# EasyEDA Pro project 验证板2.epro

# Schematic 验证板2

## Sheets
1 BUF634A三通道缓冲器: Board Name: WEN-验证板合集2; Create Date: 2025-05-11; Page Name: BUF634A三通道缓冲器; Project Name: 【电赛模块】2025电赛预制模块mmkk; Schematic Name: 验证板2; Update Date: 2025-05-13; Company: 嘉立创EDA; Page Size: A1; Version: V1.0
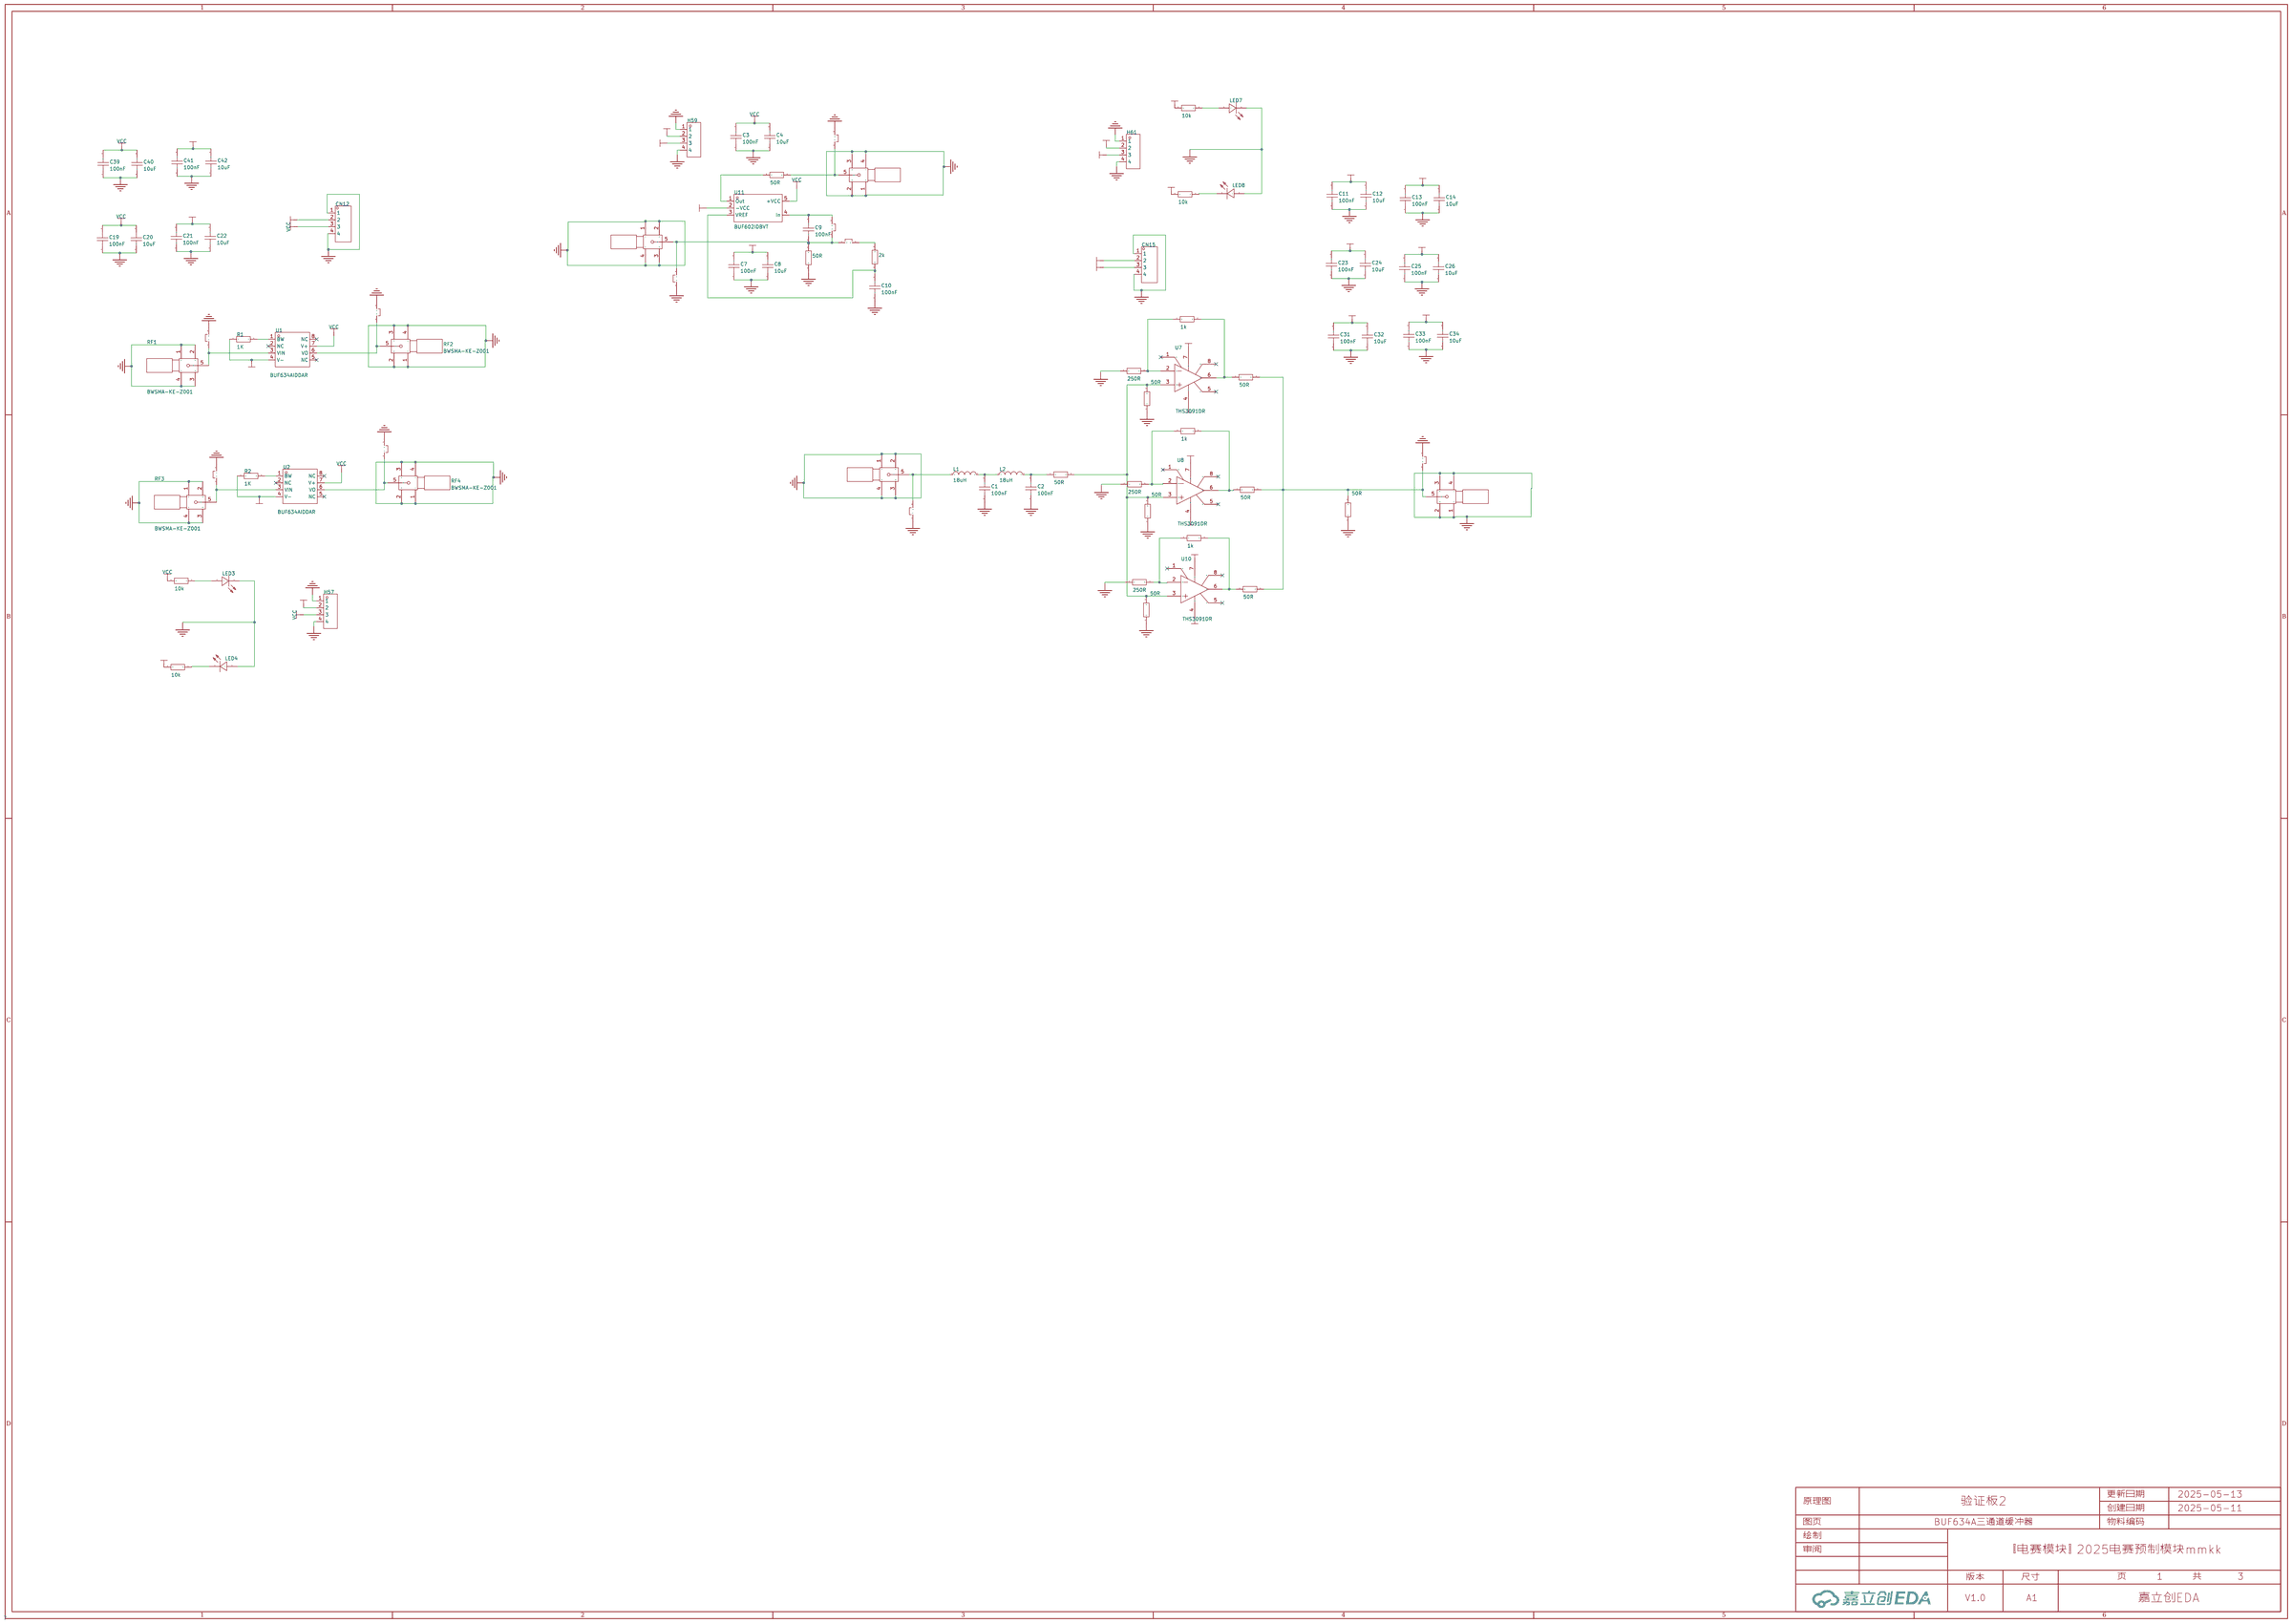
[diagram p0: BUF634A三通道缓冲器]
2 AD835乘法器: Create Date: 2025-05-13; Page Name: AD835乘法器
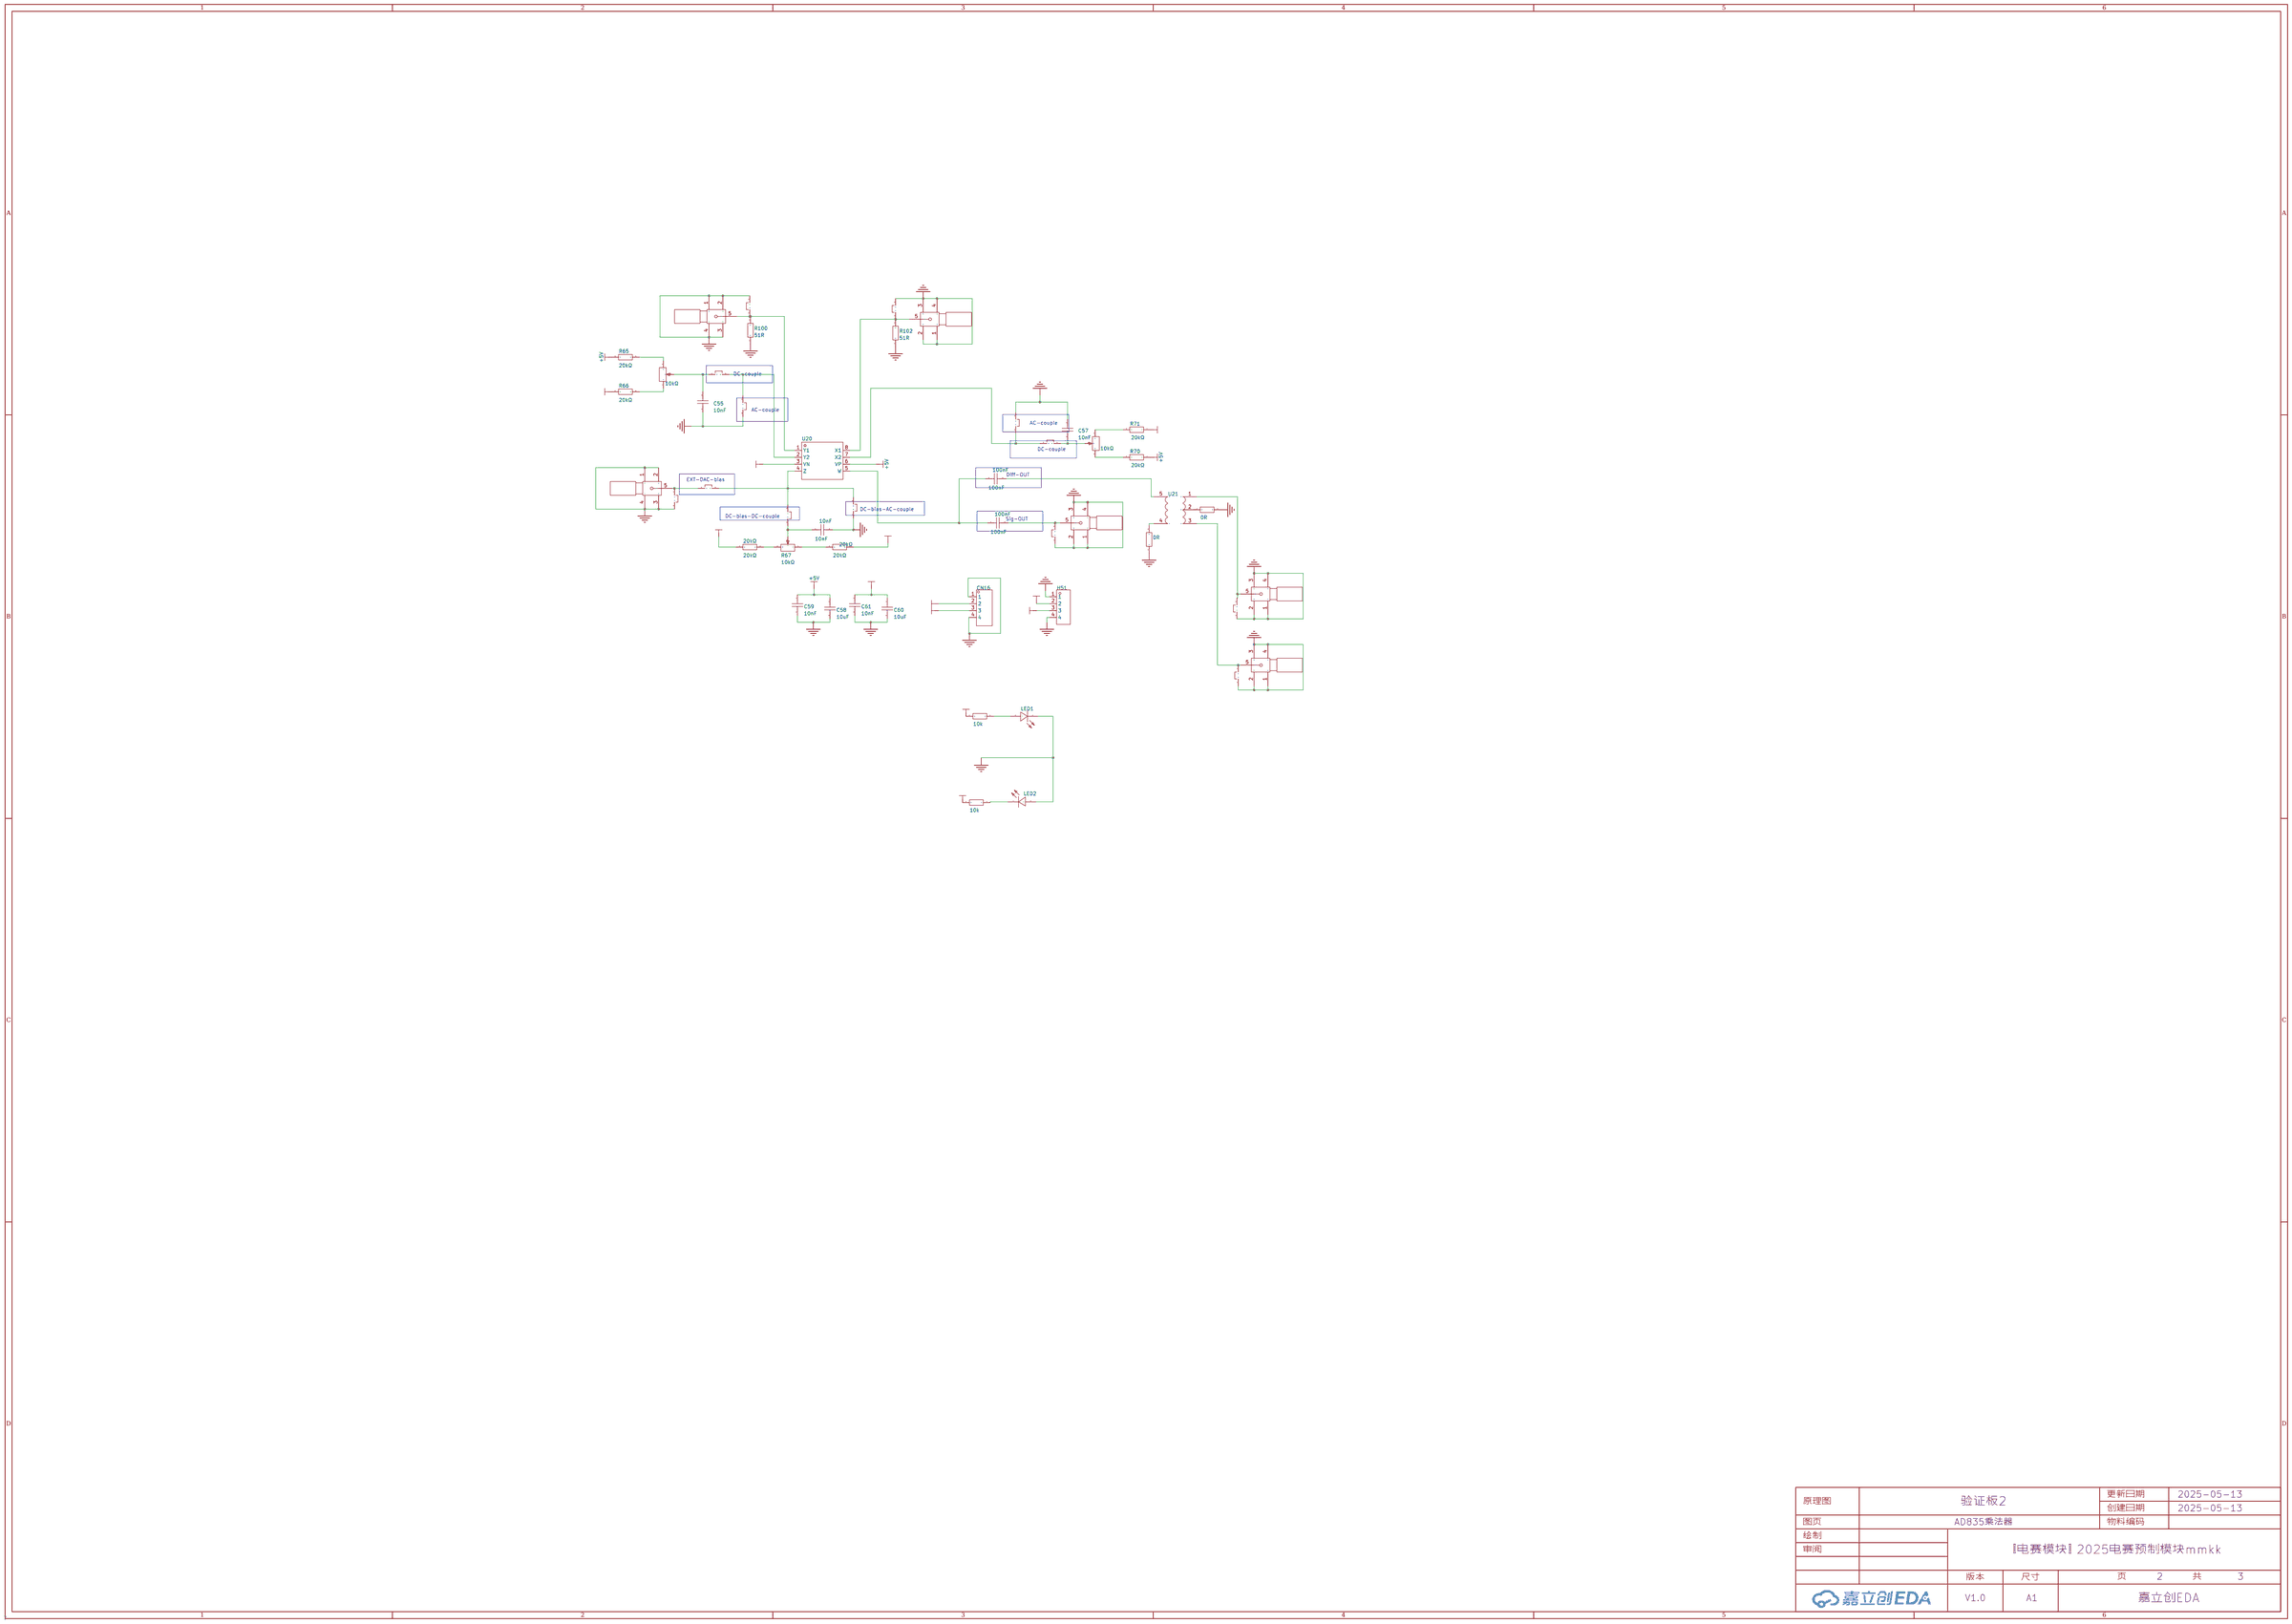
[diagram p1: AD835乘法器]
3 OPA690+CD4051数控增益AMP: Create Date: 2025-05-13; Page Name: OPA690+CD4051数控增益AMP
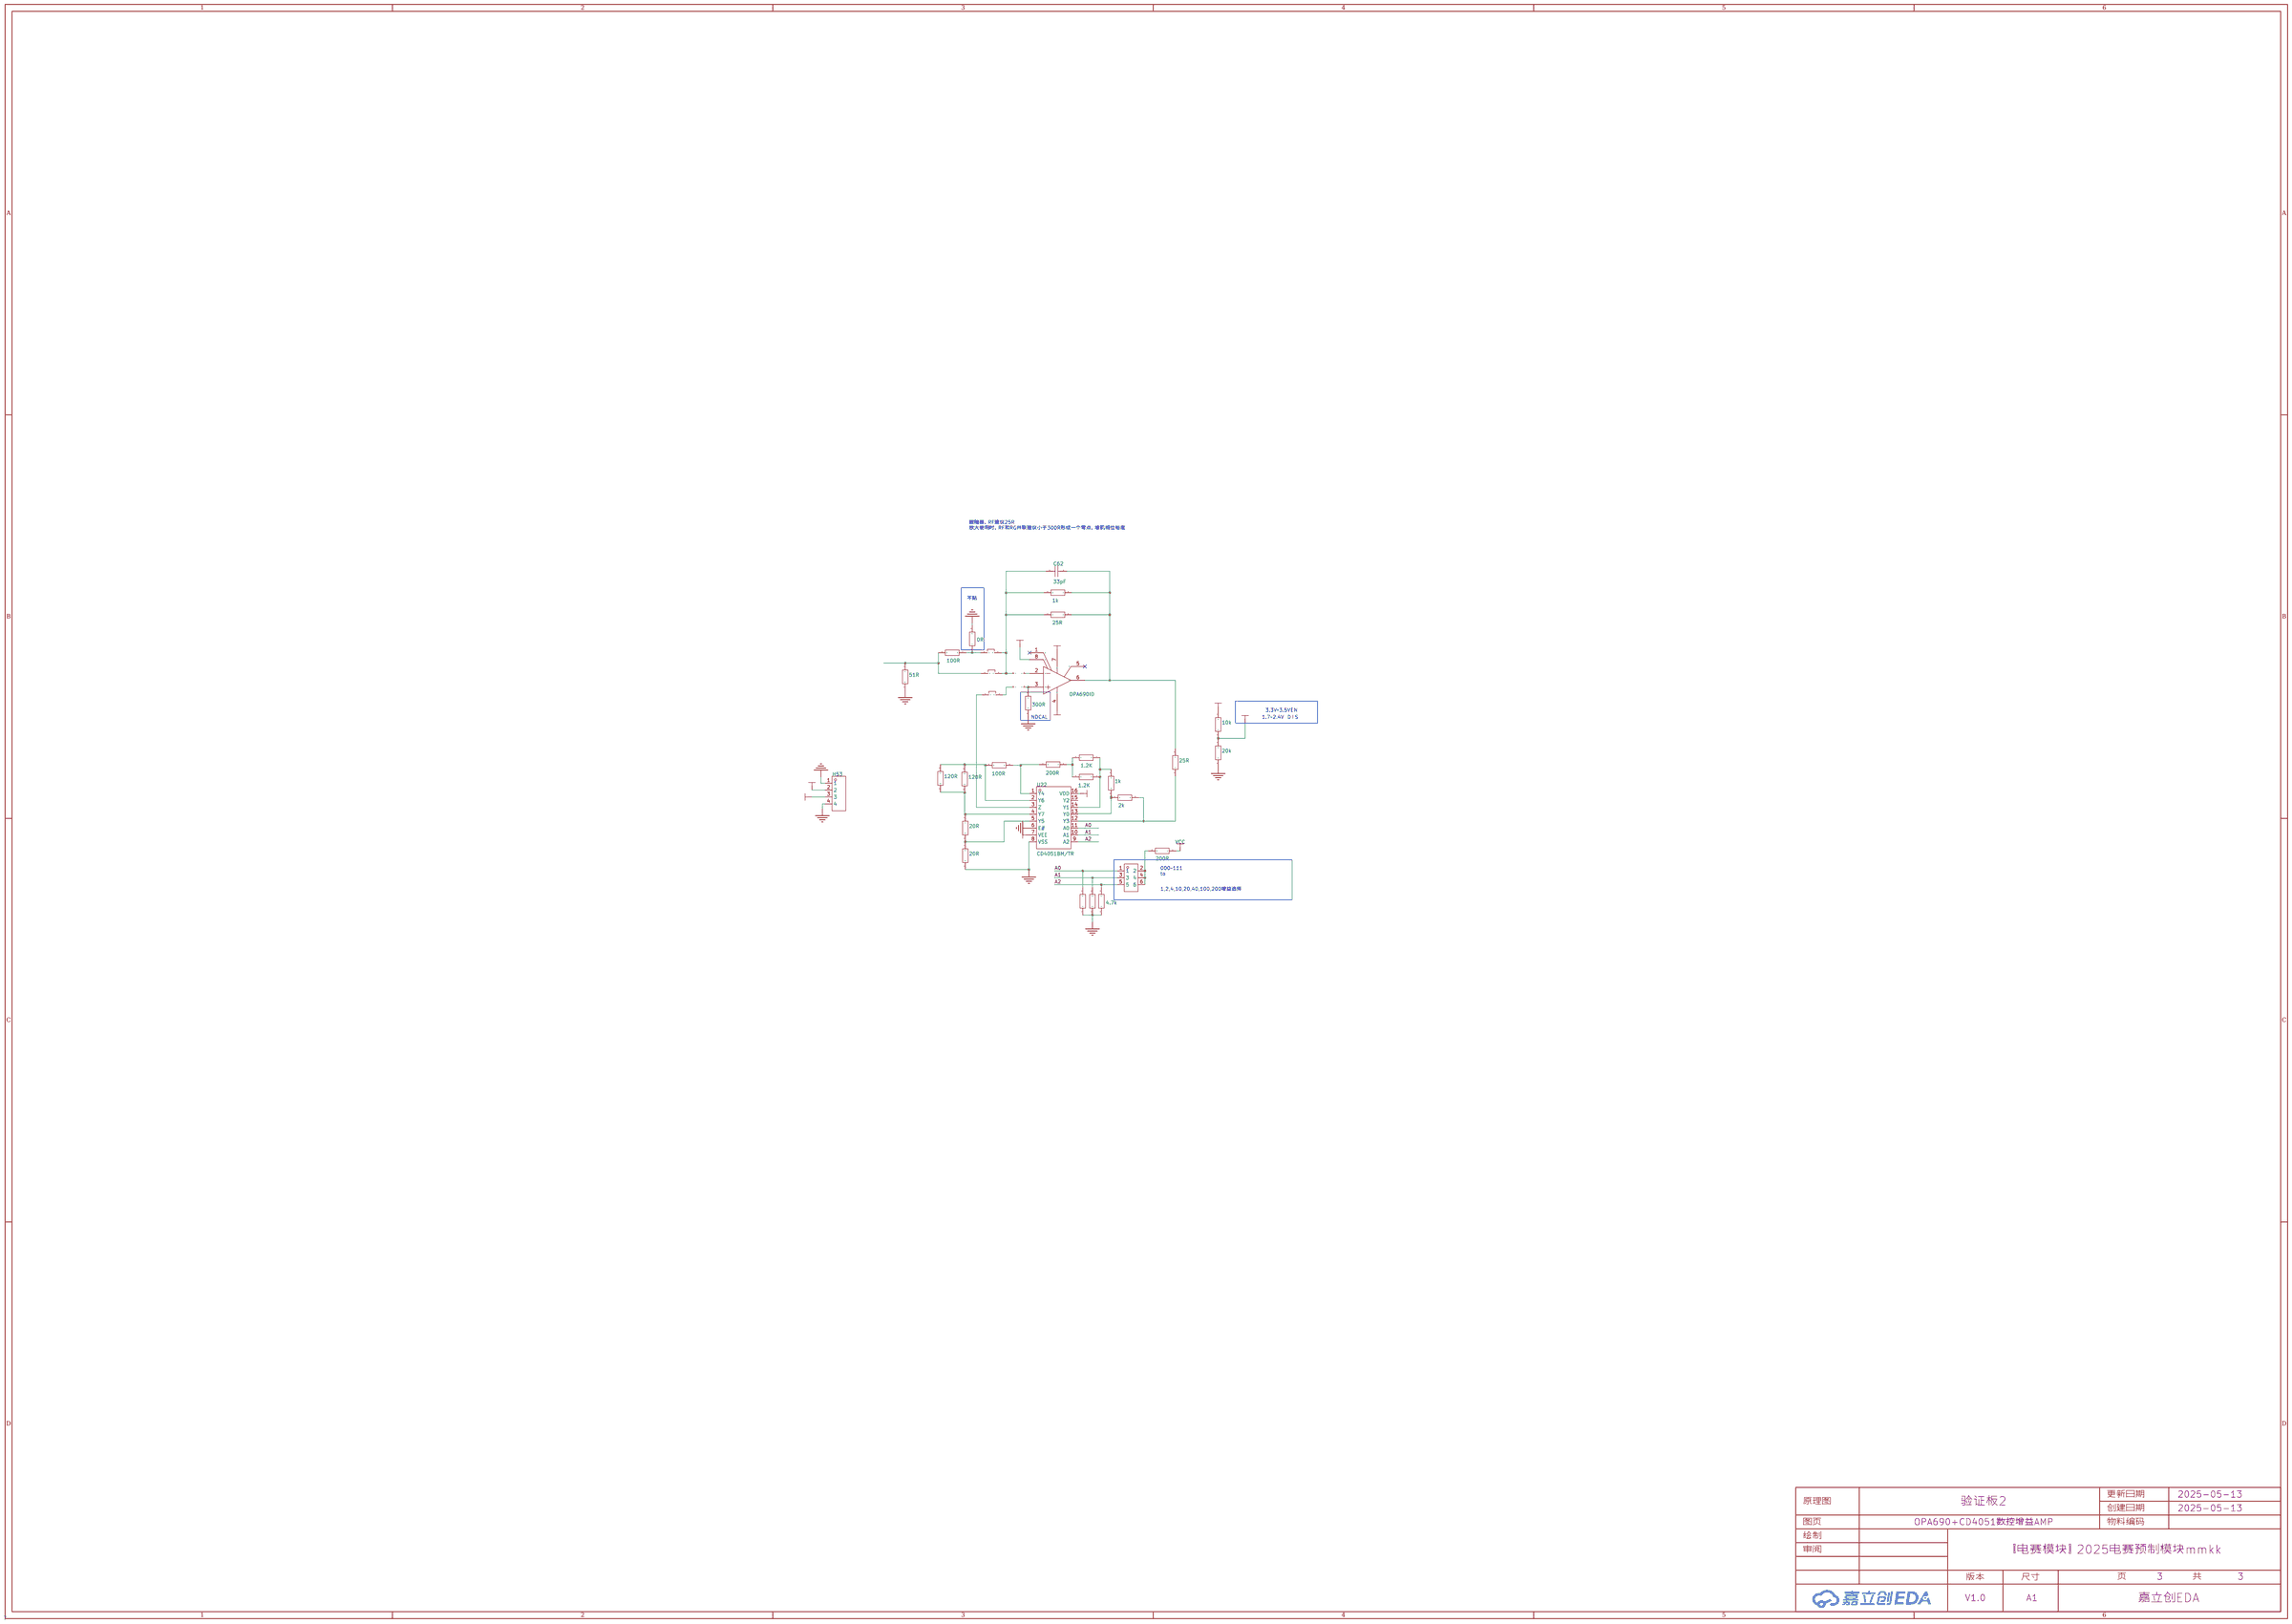
[diagram p2: OPA690+CD4051数控增益AMP]

## Parts
sheet AD835乘法器
0R1  0R  [R0603]
0R2  0R  [R0603]
10nF  10nF  [C0805]
20kΩ  20kΩ  [R0603]
20kΩ#2  20kΩ  [R0603]
100nF  100nF  [C0805]
100nF#2  100nF  [C0805]
C55  10nF  [C0805]
C57  10nF  [C0805]
C58  10uF  [C0805]
C59  10nF  [C0805]
C60  10uF  [C0805]
C61  10nF  [C0805]
CN16  WJ15EDGVC-3.81-4P  [CONN-TH_4P-P3.81_WJ2EDGVC-3.81-4P]
H34  PZ254V-11-02P  [HDR-TH_2P-P2.54-V-M]
H35  PZ254V-11-02P  [HDR-TH_2P-P2.54-V-M]
H36  PZ254V-11-02P  [HDR-TH_2P-P2.54-V-M]
H37  PZ254V-11-02P  [HDR-TH_2P-P2.54-V-M]
H38  PZ254V-11-02P  [HDR-TH_2P-P2.54-V-M]
H39  PZ254V-11-02P  [HDR-TH_2P-P2.54-V-M]
H40  PZ254V-11-02P  [HDR-TH_2P-P2.54-V-M]
H45  PZ254V-11-02P  [HDR-TH_2P-P2.54-V-M]
H46  PZ254V-11-02P  [HDR-TH_2P-P2.54-V-M]
H47  PZ254V-11-02P  [HDR-TH_2P-P2.54-V-M]
H48  PZ254V-11-02P  [HDR-TH_2P-P2.54-V-M]
H50  PZ254V-11-02P  [HDR-TH_2P-P2.54-V-M]
H51  PZ254V-11-04P  [HDR-TH_4P-P2.54-V-M]
H56  PZ254V-11-02P  [HDR-TH_2P-P2.54-V-M]
LED1  LTST-C190KSKT  [LED0603-RD]
LED2  LTST-C190KSKT  [LED0603-RD]
R65  20kΩ  [R0603]
R66  20kΩ  [R0603]
R67  10kΩ  [RES-ADJ-TH_3296W]
R70  20kΩ  [R0603]
R71  20kΩ  [R0603]
R75  0R  [R0603]
R100  51R  [R0603]
R102  51R  [R0603]
R103  0R  [R0603]
RF18  BWSMA-KE-Z001  [SMA-TH_BWSMA-KE-Z001]
RF19  BWSMA-KE-Z001  [SMA-TH_BWSMA-KE-Z001]
RF20  BWSMA-KE-Z001  [SMA-TH_BWSMA-KE-Z001]
RF21  BWSMA-KE-Z001  [SMA-TH_BWSMA-KE-Z001]
RF22  BWSMA-KE-Z001  [SMA-TH_BWSMA-KE-Z001]
RF23  BWSMA-KE-Z001  [SMA-TH_BWSMA-KE-Z001]
U20  AD835ARZ  [SOIC-8_L4.9-W3.9-P1.27-LS6.0-TL]
U21  -  [BALUN巴伦变压器（5端）]
Y3  10kΩ  [RES-ADJ-TH_3296W]
Y6  10kΩ  [RES-ADJ-TH_3296W]
sheet BUF634A三通道缓冲器
0R3  0R  [R0603]
0R4  0R  [R0603]
0R7  0R  [R0603]
0R8  0R  [R0603]
C1  100nF  [C0805]
C2  100nF  [C0805]
C3  100nF  [C0805]
C4  10uF  [C0805]
C7  100nF  [C0805]
C8  10uF  [C0805]
C9  100nF  [C0805]
C10  100nF  [C0805]
C11  100nF  [C0805]
C12  10uF  [C0805]
C13  100nF  [C0805]
C14  10uF  [C0805]
C19  100nF  [C0805]
C20  10uF  [C0805]
C21  100nF  [C0805]
C22  10uF  [C0805]
C23  100nF  [C0805]
C24  10uF  [C0805]
C25  100nF  [C0805]
C26  10uF  [C0805]
C31  100nF  [C0805]
C32  10uF  [C0805]
C33  100nF  [C0805]
C34  10uF  [C0805]
C39  100nF  [C0805]
C40  10uF  [C0805]
C41  100nF  [C0805]
C42  10uF  [C0805]
CN12  WJ15EDGVC-3.81-4P  [CONN-TH_4P-P3.81_WJ2EDGVC-3.81-4P]
CN15  WJ15EDGVC-3.81-4P  [CONN-TH_4P-P3.81_WJ2EDGVC-3.81-4P]
H1  PZ254V-11-02P  [HDR-TH_2P-P2.54-V-M]
H2  PZ254V-11-02P  [HDR-TH_2P-P2.54-V-M]
H3  PZ254V-11-02P  [HDR-TH_2P-P2.54-V-M]
H4  PZ254V-11-02P  [HDR-TH_2P-P2.54-V-M]
H5  PZ254V-11-02P  [HDR-TH_2P-P2.54-V-M]
H6  PZ254V-11-02P  [HDR-TH_2P-P2.54-V-M]
H7  PZ254V-11-02P  [HDR-TH_2P-P2.54-V-M]
H8  PZ254V-11-02P  [HDR-TH_2P-P2.54-V-M]
H9  PZ254V-11-02P  [HDR-TH_2P-P2.54-V-M]
H10  PZ254V-11-02P  [HDR-TH_2P-P2.54-V-M]
H57  PZ254V-11-04P  [HDR-TH_4P-P2.54-V-M]
H59  PZ254V-11-04P  [HDR-TH_4P-P2.54-V-M]
H61  PZ254V-11-04P  [HDR-TH_4P-P2.54-V-M]
L1  18uH  [L0805]
L2  18uH  [L0805]
LED3  LTST-C190KSKT  [LED0603-RD]
LED4  LTST-C190KSKT  [LED0603-RD]
LED7  LTST-C190KSKT  [LED0603-RD]
LED8  LTST-C190KSKT  [LED0603-RD]
R1  1K  [R0603]
R2  1K  [R0603]
R7  1K  [R0603]
R8  1K  [R0603]
R10  1K  [R0603]
R11  1K  [R0603]
R12  1K  [R0603]
R13  1K  [R0603]
R14  1K  [R0603]
R15  1K  [R0603]
R16  1K  [R0603]
R17  1K  [R0603]
R18  1K  [R0603]
R19  1K  [R0603]
R22  1K  [R0603]
R23  1K  [R0603]
R24  1K  [R0603]
R26  1K  [R0603]
R27  1K  [R0603]
RF1  BWSMA-KE-Z001  [SMA-TH_BWSMA-KE-Z001]
RF2  BWSMA-KE-Z001  [SMA-TH_BWSMA-KE-Z001]
RF3  BWSMA-KE-Z001  [SMA-TH_BWSMA-KE-Z001]
RF4  BWSMA-KE-Z001  [SMA-TH_BWSMA-KE-Z001]
RF5  BWSMA-KE-Z001  [SMA-TH_BWSMA-KE-Z001]
RF6  BWSMA-KE-Z001  [SMA-TH_BWSMA-KE-Z001]
RF7  BWSMA-KE-Z001  [SMA-TH_BWSMA-KE-Z001]
RF8  BWSMA-KE-Z001  [SMA-TH_BWSMA-KE-Z001]
U1  BUF634AIDDAR  [SOIC-8_L4.9-W3.9-P1.27-LS6.0-BL]
U2  BUF634AIDDAR  [SOIC-8_L4.9-W3.9-P1.27-LS6.0-BL]
U7  THS3091DR  [SOIC-8_L4.9-W3.9-P1.27-LS6.0-BL]
U8  THS3091DR  [SOIC-8_L4.9-W3.9-P1.27-LS6.0-BL]
U10  THS3091DR  [SOIC-8_L4.9-W3.9-P1.27-LS6.0-BL]
U11  BUF602IDBVT  [SOT-23-5_L2.9-W1.6-P0.95-LS2.8-BL]
sheet OPA690+CD4051数控增益AMP
C62  33pF  [C0805]  (no BOM)
H41  PZ254V-11-02P  [HDR-TH_2P-P2.54-V-M]  (no BOM)
H42  PZ254V-11-02P  [HDR-TH_2P-P2.54-V-M]  (no BOM)
H43  PZ254V-12-6P  [HDR-TH_6P-P2.54-V-M-R2-C3-S2.54]  (no BOM)
H44  PZ254V-11-02P  [HDR-TH_2P-P2.54-V-M]  (no BOM)
H53  PZ254V-11-04P  [HDR-TH_4P-P2.54-V-M]  (no BOM)
R72  25R  [R0603]  (no BOM)
R73  1k  [R0603]  (no BOM)
R74  100R  [R0603]  (no BOM)
R76  0R  [R0603]  (no BOM)
R77  51R  [R0603]  (no BOM)
R78  1.2K  [R0603]  (no BOM)
R79  1.2K  [R0603]  (no BOM)
R80  200R  [R0603]  (no BOM)
R81  100R  [R0603]  (no BOM)
R82  120R  [R0603]  (no BOM)
R83  120R  [R0603]  (no BOM)
R84  20R  [R0603]  (no BOM)
R85  20R  [R0603]  (no BOM)
R86  4.7k  [R0603]  (no BOM)
R87  2k  [R0603]  (no BOM)
R88  2k  [R0603]  (no BOM)
R89  2k  [R0603]  (no BOM)
R91  1k  [R0603]  (no BOM)
R92  2k  [R0603]  (no BOM)
R93  25R  [R0603]  (no BOM)
R94  300R  [R0603]  (no BOM)
R95  10k  [R0603]  (no BOM)
R96  20k  [R0603]  (no BOM)
U22  CD4051BM/TR  [SOP-16_L9.9-W3.9-P1.27-LS6.1-BL]  (no BOM)
U23  -  [短接调试焊盘]  (no BOM)
U24  -  [短接调试焊盘]  (no BOM)
U25  OPA690ID  [SOIC-8_L4.9-W3.9-P1.27-LS6.0-BL]  (no BOM)

## Library data of the parts
0R1-0R4 0R7 0R8 20kΩ 20kΩ#2 R65 R66 R70-R89 R91-R96 R100 R102 R103 = RS-06K203JT: 阻值:20kΩ;精度:±5%;功率:250mW;; LCSC Part Name: 20kΩ±5%250mW; Supplier Part: C140040; Manufacturer: FH(风华); Supplier Footprint: 1206; JLCPCB Part Class: 扩展库; Datasheet: https://atta.szlcsc.com/upload/public/pdf/source/20171106/C140040_15099444456781092137.pdf; Supplier: LCSC; Tolerance: ±5%; Power(Watts): 250mW; Temperature Coefficient: ±100ppm/; Overload Voltage (Max): 200V; Operating Temperature Range: -55~+155
10nF 100nF 100nF#2 C55 C57 C59 C61 C62 = 1206B103K500NT: 容值:10nF;精度:±10%;额定电压:50V;材质(温度系数):X7R;; LCSC Part Name: 10nF±10%50V; Supplier Part: C1846; Manufacturer: FH(风华); Supplier Footprint: 1206; JLCPCB Part Class: 基础库; Datasheet: https://atta.szlcsc.com/upload/public/pdf/source/20170923/C1846_1506149376288988599.pdf; Supplier: LCSC; Tolerance: ±10%; Voltage Rated: 50V; Temperature Coefficient: X7R
C58 C60 = CL31A106KBHNNNE: 容值:10uF;精度:±10%;额定电压:50V;材质(温度系数):X5R;; LCSC Part Name: 10uF±10%50V; Supplier Part: C13585; Manufacturer: SAMSUNG(三星); Supplier Footprint: 1206; JLCPCB Part Class: 基础库; Datasheet: https://atta.szlcsc.com/upload/public/pdf/source/20160103/1457707668742.pdf; Supplier: LCSC; Tolerance: ±10%; Voltage Rated: 50V; Temperature Coefficient: X5R
CN12 CN15 CN16 = WJ15EDGVC-3.81-4P: 连接器类型:板端/插座-闭口;固定方式:-;结构:1x4P;间距:3.81mm;颜色:-;安装方式:直针;排数:1;每排PIN数:4;额定电流:8A;额定电压:300V;线规 - AWG:-;线规 - 平方毫米:-;触头材质:黄铜;触头镀层:锡;工作温度范围:-40℃~+105℃;焊接温度(最大值):-;; LCSC Part Name: 1x4P 3.81mm 排数:1 每排P数:4; Supplier Part: C8410; Manufacturer: KANGNEX(康奈克斯电气); Supplier Footprint: 插件,P=3.81mm; JLCPCB Part Class: 扩展库; Datasheet: https://atta.szlcsc.com/upload/public/pdf/source/20191225/C8410_C8794F457058DA07325589F32B6A11CC.pdf; Supplier: LCSC; Connector Type: 板端/插座-闭口; Structure: 1x4P; Pitch: 3.81mm; Mounting Style: 直针; Number of Pins: 4P; Number of Rows: 1; Number of PINs Per Row: 4; Current Rating (Max): 8A; Voltage Rating (Max): 300V; Contact Material: 黄铜; Contact Plating: 锡; Operating Temperature Range: -40℃~+105℃
H1-H10 H34-H42 H44-H48 H50 H56 = PZ254V-11-02P: 排数:单排;总PIN位数:2;间距:2.54mm;插针结构:1x2P;行距:-;安装类型:直插;圆针/方针:方针;额定电流:-;额定电压:-;配合针长度:6mm;塑高:2.5mm;端接针长度:3mm;触头材质:黄铜;触头镀层:-;工作温度范围:-40℃~+105℃;颜色:黑色;; LCSC Part Name: 2.54mm 1x2P 直插 方针; Supplier Part: C492401; Manufacturer: XFCN(兴飞); Supplier Footprint: 直插,P=2.54mm; JLCPCB Part Class: Extended Part; Datasheet: https://atta.szlcsc.com/upload/public/pdf/source/20200309/C492401_A812433581A9B211A7FFA413ADDFF0E5.pdf; Supplier: LCSC; Number of Rows: 单排; Number of Pins: 2; Pitch: 2.54mm; Pin Structure: 1x2P; Mounting Type: 直插; Circluar Pins/Square Pins: 方针; Length of Mating Pin: 6mm; Insulation Height: 2.5mm; Length of End Connection Pin: 3mm; Contact Material: 黄铜; Operating Temperature Range: -40℃~+105℃; Color: 黑色
H51 H53 H57 H59 H61 = PZ254V-11-04P: 插针结构:1x4P;间距:2.54mm;行距:-;圆针/方针:方针;安装类型:直插;排数:单排;总PIN位数:4P;额定电流:3A;额定电压:250V;配合针长度:6mm;塑高:2.5mm;端接针长度:3mm;触头材质:-;工作温度范围:-40℃~+105℃;颜色:黑色;; LCSC Part Name: 间距:2.54mm 1x4P 直插 方针; Supplier Part: C2691448; Manufacturer: XFCN(兴飞); Supplier Footprint: 插件,P=2.54mm; JLCPCB Part Class: 扩展库; Datasheet: https://atta.szlcsc.com/upload/public/pdf/source/20200309/C492403_F9F19131791D08044AD4F84F8E751A34.pdf; Supplier: LCSC; Pin Structure: 1x4P; Pitch: 2.54mm; Circluar Pins/Square Pins: 方针; Mounting Type: 直插; Number of Rows: 单排; Number of Pins: 4P; Current Rating (Max): 3A; Voltage Rating (Max): 250V; Length of Mating Pin: 6mm; Insulation Height: 2.5mm; Length of End Connection Pin: 3mm; Operating Temperature Range: -40℃~+105℃; Color: 黑色
LED1-LED4 LED7 LED8 = LTST-C190KSKT: 发光颜色:黄色;正向电压(VF):2.1V;功率:75mW;正向电流:20mA;主波长:584.5nm~597nm;二极管配置:-;透镜颜色:无色透明透镜;色温:-;发光强度:104mcd;发光角度:130°;载带方式:-;工作温度:-30℃~+85℃;; LCSC Part Name: 黄灯; Supplier Part: C125095; Manufacturer: LITEON(光宝); Supplier Footprint: 0603; JLCPCB Part Class: 扩展库; Datasheet: https://atta.szlcsc.com/upload/public/pdf/source/20180129/C125095_15171881843821315881.pdf; Supplier: LCSC; Emitted Color: 黄色; Forward Voltage (VF): 2.1V; Power Dissipation: 75mW; Forward Current: 20mA; Dominant Wavelength: 584.5nm~597nm; Peak Wavelength: 588nm; Lens Color: 无色透明透镜; Luminous Intensity: 104mcd; Viewing Angle: 130°; Operating Temperature: -30℃~+85℃
R67 Y3 Y6 = 3296W-1-103LF: 阻值:10kΩ;精度:±10%;功率:500mW;温度系数:±100ppm/℃;; LCSC Part Name: 10kΩ ±10%; Supplier Part: C34846; Manufacturer: BOURNS; Supplier Footprint: SIP-3P,9.5x4.8mm; JLCPCB Part Class: 扩展库; Datasheet: https://atta.szlcsc.com/upload/public/pdf/source/20151026/1457707506403.pdf; Supplier: LCSC; Tolerance: ±10%; Power(Watts): 500mW; Temperature Coefficient: ±100ppm/; Turns: 25
RF1-RF8 RF18-RF23 = 【直插】BWSMA-KE-Z001_C496549: 连接器类型:板端;接口类型:内孔;端口数量:1;接口直径:-;接口长度/高度:-;频率-最大值:-;射频系列:SMA;阻抗:50Ω;样式:正脚;触头材质:-;触头镀层:-;工作温度范围:-65℃~+165℃;焊接温度(最大值):-;; LCSC Part Name: 内孔 SMA 正脚; Supplier Part: C496549; Manufacturer: BAT WIRELESS(蝙蝠无线); Supplier Footprint: 插件; JLCPCB Part Class: 扩展库; Datasheet: https://atta.szlcsc.com/upload/public/pdf/source/20221228/40BF41E56A06003A0210E1785CA66EA6.pdf; Supplier: LCSC; Connector Type: 板端; Interface Type: 内孔; Number of Ports: 1; RF Series: SMA; Impedance: 50Ω; Style: 正脚; Operating Temperature Range: -65℃~+165℃
U20 = AD835ARZ: 象限:四象限;压摆率(SR):1000V/us;带宽:250MHz;; LCSC Part Name: 250 MHz 四象限电压输出乘法器; Supplier Part: C26332; Manufacturer: ADI(亚德诺); Supplier Footprint: SOIC-8; JLCPCB Part Class: Extended Part; Datasheet: https://atta.szlcsc.com/upload/public/pdf/source/20140314/1457707016009.pdf; Supplier: LCSC; Quadrant: 四象限; Slew Rate (SR): 1000V/us; Bandwidth: 250MHz; Supply Voltage: 4.5V~5.5V; Supply Current: 25mA; Operating Temperature: -40℃~+85℃
U21 = BALUN巴伦变压器（5端）: 购买链接https://item.taobao.com/item.htm?abbucket=7&id=565148966595&ns=1&pisk=gmvjxdq6Vr4XFMXTfsmPA2eNN2B6X0kEcls9xhe4XtBYBcTwzd5O7jY11F8l6KW20U_98U_YQfb4COt6SF86jmjOWFL17IlrLnxcIO3E5vkemma34OLf61F-XGsgM05YTBLBhO3E8ANz2s0VBFobUDE8wMbRDGQTM0MRbMWOXiBtVaI1x5UvWFn5yMILWGeYMzBRrMNTMsQT2YICYSEADFK-VMbRWOCvW3HfRySsbZtjm9h6rbuuZ177BRp52VXvck2AxKSbNwtfP23JFJffJnQ7Bqd9_TQ1rp3rN3AJMESk5vg5IUA9WGT8yV5DXQT5cEuQSNJD0d_2cj3JVTbXksOSvSjW4Kt66_ixH36fl6J9klFfhCLDCsAbjDxRHUAh-shorg92L1_hNz3v43_AOCTqrRQ2O3L5TLzzLOYk6FI6yrsP3J7BItP_V621VwoSV5ViTePk2b4lHB5Aqi6SV0afesIlVwoSV5VGMgjzN0i7lTC..&priceTId=214784a717470552121325138e1c79&spm=a21n57.sem.item.1.13b53903WBUhKc&utparam=%7B%22aplus_abtest%22%3A%22a2a7b46c6d27ff540c4e224ac15cc273%22%7D&xxc=taobaoSearch; Frequency: 0.4~500Mhz
C1-C4 C7-C14 C19-C26 C31-C34 C39-C42 = CAP_0805: Supplier Footprint: 0805
L1 L2 = L_0805
R1 R2 R7 R8 R10-R19 R22-R24 R26 R27 = Res_0603: Supplier Footprint: 0603
U1 U2 = BUF634AIDDAR: 放大器数:单路;轨到轨:-;增益带宽积(GBP):-;输入失调电压(Vos):65mV;压摆率(SR):3750V/us;输入偏置电流(Ib):250nA;; Supplier Part: C2864582; Manufacturer: TI(德州仪器); Supplier Footprint: SOIC-8; JLCPCB Part Class: Extended Part; Datasheet: https://www.ti.com/cn/lit/gpn/buf634a; Supplier: LCSC; Number of Circuits: 单路; Maximum Power Supply Range (Vdd-Vss): 36V; Voltage - Input Offset(Vos): 65mV; Input Offset Voltage Drift (Vos TC): 175uV/℃; Slew Rate(SR): 3750V/us; Current - Input Bias(Ib): 250nA; Noise density(eN): 3.4nV/√Hz@1kHz; Output Current: 250mA; Operating Temperature: -40℃~+125℃
U7 U8 U10 = THS3091DR: 放大器数:单路;增益带宽积(GBP):-;输入偏置电流(Ib):4uA;压摆率(SR):7300V/us;带宽(-3db):235MHz;; Supplier Part: C2060367; Manufacturer: TI(德州仪器); Supplier Footprint: SOIC-8; JLCPCB Part Class: 扩展库; Datasheet: https://www.ti.com/cn/lit/gpn/ths3091; Supplier: LCSC; Number of Circuits: 单路; Current - Input Bias(Ib): 4uA; Slew Rate(SR): 7300V/us; Output Current: 280mA; -3db Bandwidth: 235MHz; Operating Temperature: -40℃~+85℃
U11 = BUF602IDBVT: 放大器数:单路;轨到轨:-;增益带宽积(GBP):1GHz;输入失调电压(Vos):30mV;压摆率(SR):8000V/us;输入偏置电流(Ib):3uA;; Supplier Part: C2862949; Manufacturer: TI(德州仪器); Supplier Footprint: SOT-23-5; JLCPCB Part Class: 扩展库; Datasheet: https://www.ti.com/cn/lit/gpn/buf602; Supplier: LCSC; Number of Circuits: 单路; Maximum Power Supply Range (Vdd-Vss): 12.6V; Gain Bandwidth Product(GBP): 1GHz; Voltage - Input Offset(Vos): 30mV; Slew Rate(SR): 8000V/us; Current - Input Bias(Ib): 3uA; Output Current: 60mA; Operating Temperature: -45℃~+85℃
H43 = PZ254V-12-6P: 插针结构:2x3P;间距:2.54mm;行距:2.54mm;圆针/方针:方针;安装类型:直插;排数:双排;总PIN位数:6P;额定电流:-;额定电压:-;配合针长度:6mm;塑高:2.5mm;端接针长度:3mm;触头材质:黄铜;触头镀层:-;工作温度范围:-40℃~+105℃;颜色:黑色;; LCSC Part Name: 间距:2.54mm 2x3P 直插 方针; Supplier Part: C492420; Manufacturer: XFCN(兴飞); Supplier Footprint: 插件,P=2.54mm; JLCPCB Part Class: Extended Part; Datasheet: https://atta.szlcsc.com/upload/public/pdf/source/20200309/C492420_BAECB307B001054C09D200388220EAE6.pdf; Supplier: LCSC; Pin Structure: 2x3P; Pitch: 2.54mm; Row Spacing: 2.54mm; Circluar Pins/Square Pins: 方针; Mounting Type: 直插; Number of Rows: 双排; Number of Pins: 6P; Length of Mating Pin: 6mm; Insulation Height: 2.5mm; Length of End Connection Pin: 3mm; Contact Material: 黄铜; Operating Temperature Range: -40℃~+105℃; Color: 黑色
U22 = CD4051BM/TR: 开关电路:单刀八掷(SP8T);通道数:8;导通电阻(Ron@VCC):60Ω;; LCSC Part Name: CD4051B 单刀八掷模拟开关; Supplier Part: C507163; Manufacturer: HGSEMI(华冠); Supplier Footprint: SOP-16; JLCPCB Part Class: 扩展库; Datasheet: https://atta.szlcsc.com/upload/public/pdf/source/20240320/7BB009024CA6631C42E25AC5CB4174DD.pdf; Supplier: LCSC; Switch Circuit: 单刀八掷(SP8T); Number of Channels: 8; Supply Voltage: 3V~15V; On-State Resistance (Max): 60Ω; Operating Temperature: -40℃~+85℃
U23 U24 = 短接焊锡焊盘
U25 = OPA690ID: 放大器数:单路;增益带宽积(GBP):300MHz;输入偏置电流(Ib):3uA;压摆率(SR):1800V/us;带宽(-3db):500MHz;; Supplier Part: C1346889; Manufacturer: TI(德州仪器); Supplier Footprint: SOIC-8; JLCPCB Part Class: 扩展库; Datasheet: https://www.ti.com/cn/lit/gpn/opa690; Supplier: LCSC; Number of Circuits: 单路; Gain Bandwidth Product(GBP): 300MHz; Current - Input Bias(Ib): 3uA; Slew Rate(SR): 1800V/us; Output Current: 190mA; -3db Bandwidth: 500MHz; Operating Temperature: -40℃~+85℃

## Nets
5V: R95.1
+5V: 0R1.2 20kΩ.2 C58.1 C59.1 CN16.3 H51.3 H53.3 R65.1 R70.1 U20.6(VP) U22.16(VDD) U25.7(+VS)
-5V: 0R2.2 20kΩ#2.1 C60.1 C61.1 CN16.2 H51.2 H53.2 R66.1 R71.1 U20.3(VN) U22.7(VEE) U25.4(-VS)
GND: 10nF.2 C1.1 C2.1 C3.1 C4.1 C7.1 C8.1 C10.1 C11.1 C12.1 C13.1 C14.1 C19.1 C20.1 C21.1 C22.1 C23.1 C24.1 C25.1 C26.1 C31.1 C32.1 C33.1 C34.1 C39.1 C40.1 C41.1 C42.1 C55.1 C57.1 C58.2 C59.2 C60.2 C61.2 CN12.1 CN12.4 CN15.1 CN15.4 CN16.1 CN16.4 H1.1 H2.2 H3.1 H4.2 H5.1 H6.1 H7.1 H8.1 H36.2 H38.1 H40.2 H45.2 H46.2 H47.1 H48.1 H50.1 H51.1 H51.4 H53.1 H53.4 H56.2 H57.1 H57.4 H59.1 H59.4 H61.1 H61.4 LED1.1(-) LED2.2(+) LED3.1(-) LED4.2(+) LED7.1(-) LED8.2(+) R12.1 R14.1 R16.1 R17.1 R18.1 R19.1 R23.1 R24.1 R75.2 R76.2 R77.2 R85.2 R86.1 R87.1 R88.1 R94.2 R96.2 R100.1 R102.1 R103.1 RF1.1 RF1.2 RF1.3 RF1.4 RF2.1 RF2.2 RF2.3 RF2.4 RF3.1 RF3.2 RF3.3 RF3.4 RF4.1 RF4.2 RF4.3 RF4.4 RF5.1 RF5.2 RF5.3 RF5.4 RF6.1 RF6.2 RF6.3 RF6.4 RF7.1 RF7.2 RF7.3 RF7.4 RF8.1 RF8.2 RF8.3 RF8.4 RF18.1 RF18.2 RF18.3 RF18.4 RF19.1 RF19.2 RF19.3 RF19.4 RF20.1 RF20.2 RF20.3 RF20.4 RF21.1 RF21.2 RF21.3 RF21.4 RF22.1 RF22.2 RF22.3 RF22.4 RF23.1 RF23.2 RF23.3 RF23.4 U22.6(E#) U22.8(VSS)
VCC: 0R3.2 C3.2 C4.2 C19.2 C20.2 C39.2 C40.2 CN12.3 H57.3 H59.3 R89.1 U1.7(V+) U2.7(V+) U11.5(+VCC)
VDD: 0R7.2 C11.2 C12.2 C23.2 C24.2 C31.2 C32.2 CN15.2 H61.3 U7.7(VS+) U8.7(VS+) U10.7(VS+)
VEE: 0R4.2 C7.2 C8.2 C21.2 C22.2 C41.2 C42.2 CN12.2 H57.2 H59.2 R1.1 R2.1 U1.4(V-) U2.4(V-) U11.2(−VCC)
VSS: 0R8.2 C13.2 C14.2 C25.2 C26.2 C33.2 C34.2 CN15.3 H61.2 U7.4(VS-) U8.4(VS-) U10.4(VS-)
A0: H43.1 R86.2 U22.11(A0)
A1: H43.3 R87.2 U22.10(A1)
A2: H43.5 R88.2 U22.9(A2)
ENA: R95.2 R96.1 U25.8(DIS#)
Net-(0R1-1): 0R1.1 LED1.2(+)
Net-(0R2-1): 0R2.1 LED2.1(-)
Net-(0R3-1): 0R3.1 LED3.2(+)
Net-(0R4-1): 0R4.1 LED4.1(-)
Net-(0R7-1): 0R7.1 LED7.2(+)
Net-(0R8-1): 0R8.1 LED8.1(-)
Net-(10nF-1): 10nF.1 H35.2 R67.2
Net-(20kΩ#2-2): 20kΩ#2.2 R67.3
Net-(20kΩ-1): 20kΩ.1 R67.1
Net-(100nF#2-2): 100nF#2.2 U21.5
Net-(100nF-1): 100nF.1 100nF#2.1 U20.5(W)
Net-(100nF-2): 100nF.2 H47.2 RF21.5
Net-(C1-2): C1.2 L1.2 L2.1
Net-(C2-2): C2.2 L2.2 R22.1
Net-(C9-1): C9.1 H7.2 H9.2 H10.1 R24.2 RF7.5
Net-(C9-2): C9.2 H9.1 U11.4(In)
Net-(C10-2): C10.2 R27.1 U11.3(VREF)
Net-(C55-2): C55.2 H39.1 Y3.2
Net-(C57-2): C57.2 H37.2 Y6.2
Net-(C62-1): C62.1 H41.2 H42.2 R72.2 R73.2 U23.1
Net-(C62-2): C62.2 R72.1 R73.1 R93.2 U25.6(OUT)
Net-(H1-2): H1.2 RF2.5 U1.6(VO)
Net-(H2-1): H2.1 RF1.5 U1.3(VIN)
Net-(H3-2): H3.2 RF4.5 U2.6(VO)
Net-(H4-1): H4.1 RF3.5 U2.3(VIN)
Net-(H5-2): H5.2 L1.1 RF5.5
Net-(H6-2): H6.2 R7.2 R8.2 R10.2 R23.2 RF6.5
Net-(H8-2): H8.2 R26.1 RF8.5
Net-(H10-2): H10.2 R27.2
Net-(H34-1): H34.1 H56.1 RF20.5
Net-(H34-2): H34.2 H35.1 H36.1 U20.4(Z)
Net-(H37-1): H37.1 H38.2 U20.7(X2)
Net-(H39-2): H39.2 H40.1 U20.2(Y2)
Net-(H41-1): H41.1 R74.1 R76.1
Net-(H42-1): H42.1 R74.2 R77.1
Net-(H43-2): H43.2 H43.4 H43.6 R89.2
Net-(H44-1): H44.1 U22.3(Z)
Net-(H44-2): H44.2 U24.1
Net-(H45-1): H45.1 R100.2 RF18.5 U20.1(Y1)
Net-(H46-1): H46.1 R102.2 RF19.5 U20.8(X1)
Net-(H48-2): H48.2 RF22.5 U21.1
Net-(H50-2): H50.2 RF23.5 U21.3
Net-(R1-2): R1.2 U1.1(BW)
Net-(R2-2): R2.2 U2.1(BW)
Net-(R7-1): R7.1 R11.2 U7.6(VOUT)
Net-(R8-1): R8.1 R13.2 U8.6(VOUT)
Net-(R10-1): R10.1 R15.2 U10.6(VOUT)
Net-(R11-1): R11.1 R12.2 U7.2(VIN-)
Net-(R13-1): R13.1 R14.2 U8.2(VIN-)
Net-(R15-1): R15.1 R16.2 U10.2(VIN-)
Net-(R17-2): R17.2 R18.2 R19.2 R22.2 U7.3(VIN+) U8.3(VIN+) U10.3(VIN+)
Net-(R26-2): R26.2 U11.1(Out)
Net-(R65-2): R65.2 Y3.3
Net-(R66-2): R66.2 Y3.1
Net-(R70-2): R70.2 Y6.3
Net-(R71-2): R71.2 Y6.1
Net-(R75-1): R75.1 U21.2
Net-(R78-1): R78.1 R79.1 R91.1 U22.14(Y1)
Net-(R78-2): R78.2 R79.2 R80.1
Net-(R80-2): R80.2 R81.1 U22.1(Y4)
Net-(R81-2): R81.2 R82.1 R83.1 U22.2(Y6)
Net-(R82-2): R82.2 R83.2 R84.1 U22.4(Y7)
Net-(R84-2): R84.2 R85.1 U22.5(Y5)
Net-(R91-2): R91.2 R92.1 U22.13(Y0)
Net-(R92-2): R92.2 R93.1 U22.12(Y3)
Net-(R94-1): R94.1 U24.2 U25.3(IN+)
Net-(R103-2): R103.2 U21.4
Net-(U23-2): U23.2 U25.2(IN-)

Not connected (* = marked no-connect by the designer): U1 2(NC)* 5(NC)* 8(NC)*; U2 2(NC)* 5(NC)* 8(NC)*; U7 1(NC)* 5(NC)* 8(NC)*; U8 1(NC)* 5(NC)* 8(NC)*; U10 1(NC)* 5(NC)* 8(NC)*; U22 15(Y2); U25 1(NC)* 5(NC)*

## Notes on the sheets
sheet 2
- DC-couple
- AC-couple
- AC-couple
- DC-couple
- Diff-OUT
- EXT-DAC-bias
- DC-bias-AC-couple
- DC-bias-DC-couple
- Sig-OUT
sheet 3
- 跟随器，RF建议25R
  放大使用时，RF和RG并联建议小于300R形成一个零点，增肌相位裕度
- 不贴
- 3.3V~3.5VＥＮ
- NDCAL
- 1.7~2.4V　ＤＩＳ
- 000~111
  to
- 1,2,4,10,20,40,100,200增益选择
